# EAGLE board ArduinoInterface_v3.1 (EAGLE 9.2.1)
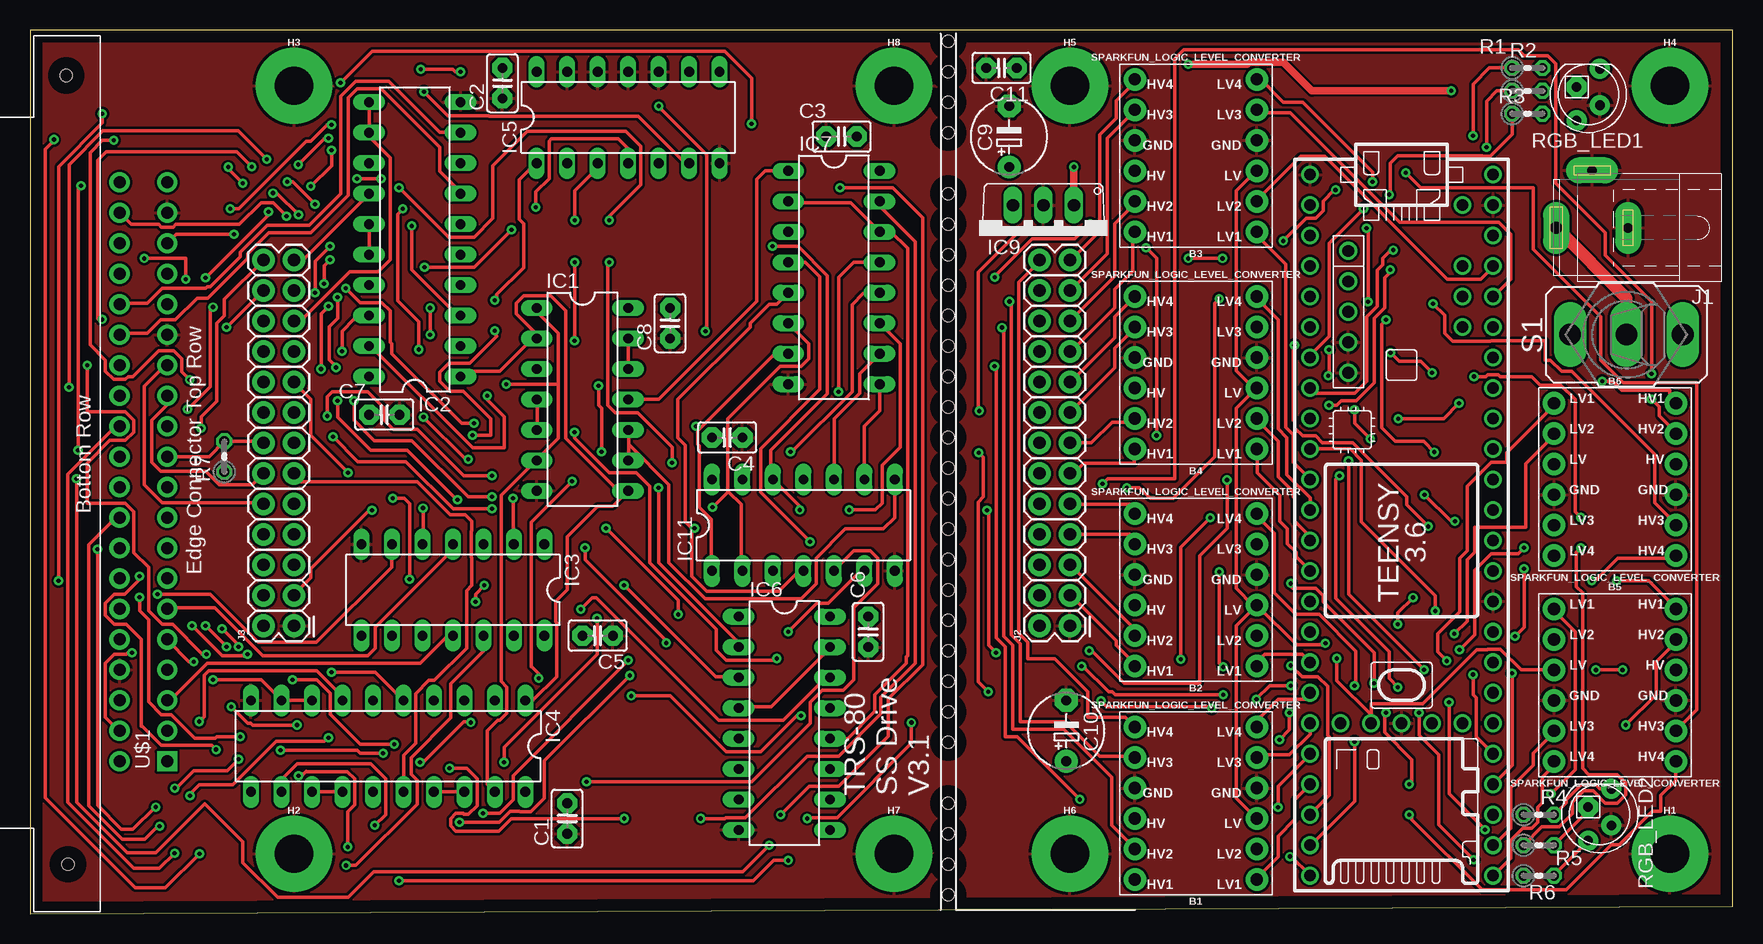
[diagram p1: board, top side]
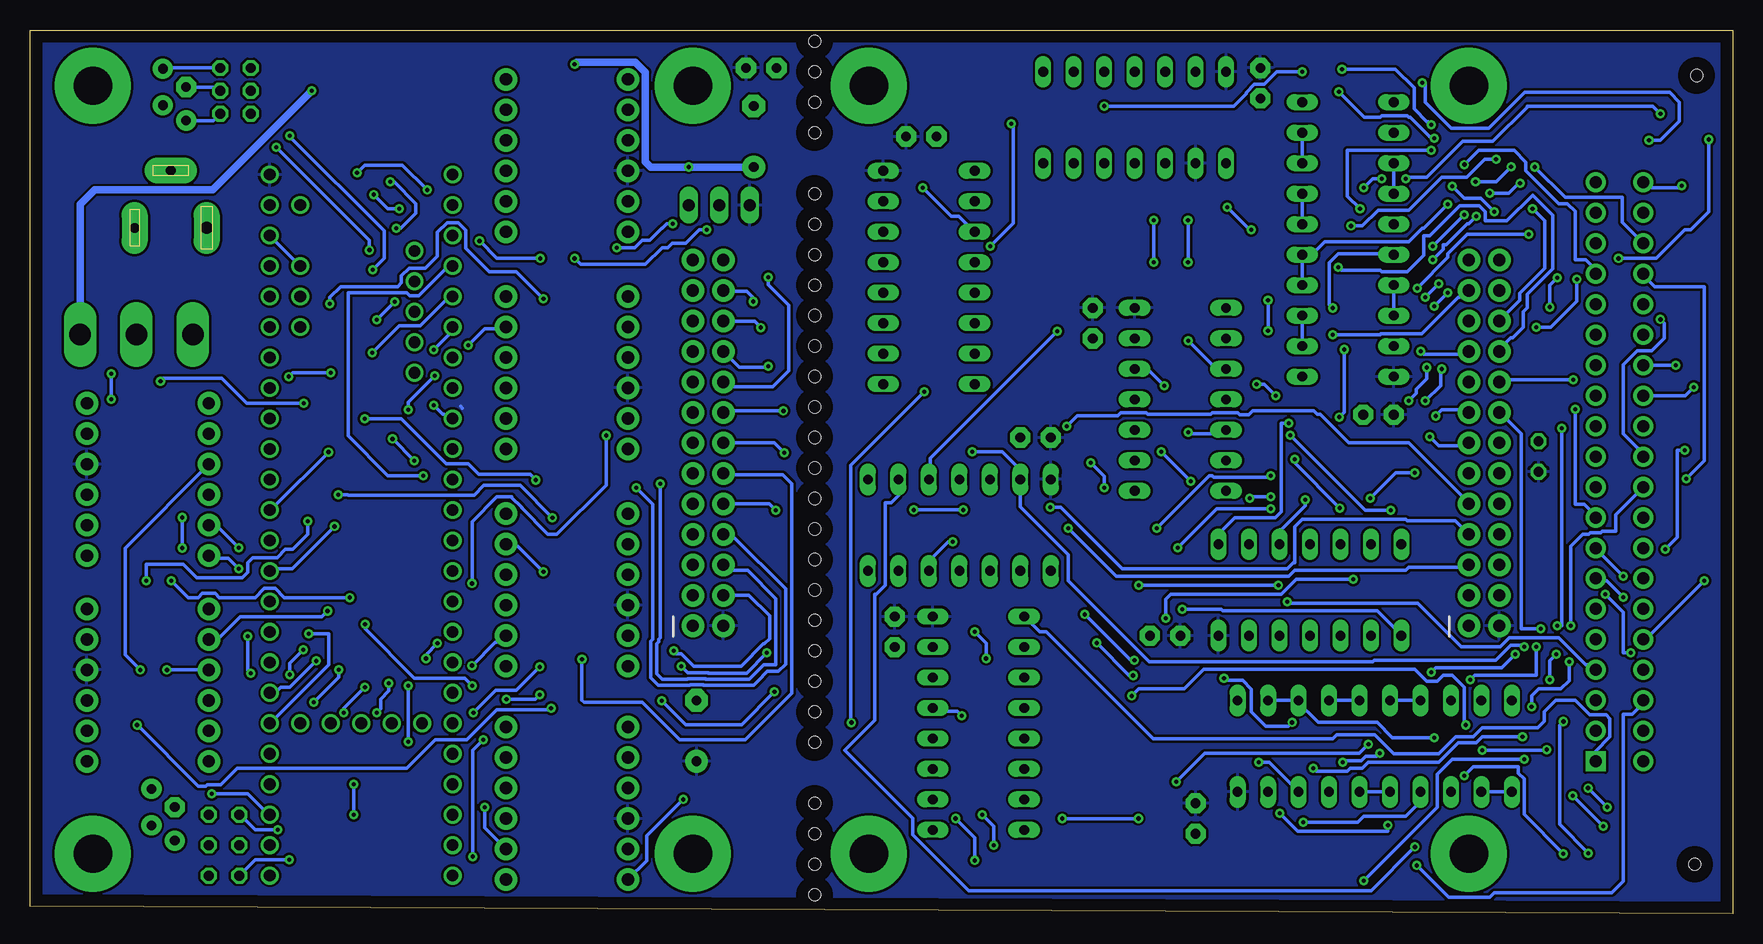
[diagram p2: board, bottom side, seen from below]

Size 141.9 x 73.65 mm. Coordinates in mm from the lower left corner, seen from the top.
Outline: 0,0 141.9,0.64 141.9,73.65 0,73.65 0,0
Copper layers (1*16): Top 0.035mm / dielectric 1.5mm / Bottom 0.035mm
Design rules "default": minimum track width 0.2mm, minimum drill 0.35mm, track to track 8mil, track to pad 8mil, pad to pad 8mil, via to via 8mil, smd to smd 8mil, copper to edge 40mil, drill to drill 6mil, minimum pad ring 10mil, minimum via ring 8mil, stop-mask expansion 4mil, vias tented up to drill 0mil, thermal gap 10mil
Net classes: 0 default: width 0.3 mm, clearance 0.05 mm
Holes 1 mm at 76.52,72.71 76.52,67.63 76.52,60.01 76.52,57.47 76.52,52.39 76.52,49.85 76.52,47.31 76.52,42.23 76.52,39.69 76.52,32.07 76.52,29.53 76.52,26.99 76.52,21.91 76.52,19.37 76.52,16.83 76.52,6.67 76.52,1.59 76.52,14.29 76.52,24.45 76.52,34.61 76.52,44.77 76.52,54.93 76.52,9.21 76.52,65.09 76.52,70.17 76.52,4.13 76.52,37.15

## Footprints (pad centres in the part's own frame; a part is rotated, then mirrored left to right if it is on the bottom)
SPARKFUN_LOGIC_LEVEL_CONVERTER = drill 1.016 pad 1.88: GND1 -5.08,-1.27; GND2 5.08,-1.27; HV 5.08,1.27; HV1 5.08,6.35; HV2 5.08,3.81; HV3 5.08,-3.81; HV4 5.08,-6.35; LV -5.08,1.27; LV1 -5.08,6.35; LV2 -5.08,3.81; LV3 -5.08,-3.81; LV4 -5.08,-6.35
C025-025X050 = drill 0.813 pad 1.676 octagon: 1 -1.27,0; 2 1.27,0
E5-6 = drill 0.813 pad 1.905: + -2.54,0 | drill 0.813 pad 1.905 octagon: - 2.54,0
STANDOFF-ELECTRICAL = drill 3.2 pad 6.35: P1 0,0
DIL14 = drill 0.813 long: 1 -7.62,-3.81; 2 -5.08,-3.81; 3 -2.54,-3.81; 4 0,-3.81; 5 2.54,-3.81; 6 5.08,-3.81; 7 7.62,-3.81; 8 7.62,3.81; 9 5.08,3.81; 10 2.54,3.81; 11 0,3.81; 12 -2.54,3.81; 13 -5.08,3.81; 14 -7.62,3.81
DIL20 = drill 0.813 long: 1 -11.43,-3.81; 2 -8.89,-3.81; 3 -6.35,-3.81; 4 -3.81,-3.81; 5 -1.27,-3.81; 6 1.27,-3.81; 7 3.81,-3.81; 8 6.35,-3.81; 9 8.89,-3.81; 10 11.43,-3.81; 11 11.43,3.81; 12 8.89,3.81; 13 6.35,3.81; 14 3.81,3.81; 15 1.27,3.81; 16 -1.27,3.81; 17 -3.81,3.81; 18 -6.35,3.81; 19 -8.89,3.81; 20 -11.43,3.81
DIL16 = drill 0.813 long: 1 -8.89,-3.81; 2 -6.35,-3.81; 3 -3.81,-3.81; 4 -1.27,-3.81; 5 1.27,-3.81; 6 3.81,-3.81; 7 6.35,-3.81; 8 8.89,-3.81; 9 8.89,3.81; 10 6.35,3.81; 11 3.81,3.81; 12 1.27,3.81; 13 -1.27,3.81; 14 -3.81,3.81; 15 -6.35,3.81; 16 -8.89,3.81
TO220V = drill 1.016 long: 1 -2.54,-2.54; 2 0,-2.54; 3 2.54,-2.54
SPC4077 = drill 0.8 pad 2.184 long: 1 -3,0; 2 0,-4.8 | drill 1 pad 2.184 long: 3 3,0
2X13 = drill 1.016 pad 1.88: 1 0,0; 2 0,2.54; 3 2.54,0; 4 2.54,2.54; 5 5.08,0; 6 5.08,2.54; 7 7.62,0; 8 7.62,2.54; 9 10.16,0; 10 10.16,2.54; 11 12.7,0; 12 12.7,2.54; 13 15.24,0; 14 15.24,2.54; 15 17.78,0; 16 17.78,2.54; 17 20.32,0; 18 20.32,2.54; 19 22.86,0; 20 22.86,2.54; 21 25.4,0; 22 25.4,2.54; 23 27.94,0; 24 27.94,2.54; 25 30.48,0; 26 30.48,2.54
0204V = drill 0.813 octagon: 1 -1.27,0; 2 1.27,0
LED5MMRGB = drill 0.8 pad 1.676: 1 -2.159,0.968; 3 0.889,0.968; 4 2.159,-0.968 | drill 0.8 pad 1.676 octagon: 2 -0.635,-0.968
M9040P = drill 1.803 long: 1 0,4.699; 2 0,0; 3 0,-4.699
EBC20DRAS = drill 1 pad 1.676 square: P$1 0,0 | drill 1 pad 1.676: P$2 0,3.969; P$3 2.54,0; P$4 2.54,3.969; P$5 5.08,0; P$6 5.08,3.969; P$7 7.62,0; P$8 7.62,3.969; P$9 10.16,0; P$10 10.16,3.969; P$11 12.7,0; P$12 12.7,3.969; P$13 15.24,0; P$14 15.24,3.969; P$15 17.78,0; P$16 17.78,3.969; P$17 20.32,0; P$18 20.32,3.969; P$19 22.86,0; P$20 22.86,3.969; P$21 25.4,0; P$22 25.4,3.969; P$23 27.94,0; P$24 27.94,3.969; P$25 30.48,0; P$26 30.48,3.969; P$27 33.02,0; P$28 33.02,3.969; P$29 35.56,0; P$30 35.56,3.969; P$31 38.1,0; P$32 38.1,3.969; P$33 40.64,0; P$34 40.64,3.969; P$35 43.18,0; P$36 43.18,3.969; P$37 45.72,0; P$38 45.72,3.969; P$39 48.26,0; P$40 48.26,3.969 | hole 1: -8.572,8.255; 57.15,8.414
TEENSY_3.5/3.6 = drill 0.965: 0/RX -25.4,-7.62; 1/TX -22.86,-7.62; 2 -20.32,-7.62; 3/CANTX -17.78,-7.62; 3V3 7.62,-7.62; 3V3_2 17.78,-2.54; 3V3_LO -22.86,7.62; 4/CANRX -15.24,-7.62; 5 -12.7,-7.62; 6 -10.16,-7.62; 7 -7.62,-7.62; 8 -5.08,-7.62; 9/CS -2.54,-7.62; 10/CS 0,-7.62; 11/MOSI 2.54,-7.62; 12/MISO 5.08,-7.62; 13/SCK 5.08,7.62; 14/A0 2.54,7.62; 15/A1 0,7.62; 16/A2 -2.54,7.62; 17/A3 -5.08,7.62; 18/A4/SDA -7.62,7.62; 19/A5/SCL -10.16,7.62; 20/A6 -12.7,7.62; 21/A7 -15.24,7.62; 21/DAC0 12.7,7.62; 22/A8 -17.78,7.62; 23/A9 -20.32,7.62; 24 10.16,-7.62; 25 12.7,-7.62; 26 15.24,-7.62; 27 17.78,-7.62; 28 20.32,-7.62; 29 22.86,-7.62; 30 25.4,-7.62; 31/A12 27.94,-7.62; 32/A13 30.48,-7.62; 33/A14 30.48,7.62; 34/A15 27.94,7.62; 35/A16 25.4,7.62; 36/A17 22.86,7.62; 37/A18 20.32,7.62; 38/A19 17.78,7.62; 39/A20 15.24,7.62; A10 -17.78,5.08; A11 -15.24,5.08; A22/DAC1 10.16,7.62; AGND -25.4,7.62; AREF -20.32,5.08; GND -27.94,-7.62; GND2 7.62,7.62; GND3 17.78,0; PROG 17.78,2.54; RESET 17.78,5.08; U5V -21.59,-4.445; UD+ -16.51,-4.445; UD- -19.05,-4.445; UGND1 -13.97,-4.445; UGND2 -11.43,-4.445; VBAT 17.78,-5.08; VIN -27.94,7.62; VUSB -25.4,5.08

## Placement (x,y rotation side)
B1  SPARKFUN_LOGIC_LEVEL_CONVERTER  [SPARKFUN_LOGIC_LEVEL_CONVERTER]  97.16,9.21 180 top
B2  SPARKFUN_LOGIC_LEVEL_CONVERTER  [SPARKFUN_LOGIC_LEVEL_CONVERTER]  97.16,26.99 180 top
B3  SPARKFUN_LOGIC_LEVEL_CONVERTER  [SPARKFUN_LOGIC_LEVEL_CONVERTER]  97.16,63.18 180 top
B4  SPARKFUN_LOGIC_LEVEL_CONVERTER  [SPARKFUN_LOGIC_LEVEL_CONVERTER]  97.16,45.09 180 top
B5  SPARKFUN_LOGIC_LEVEL_CONVERTER  [SPARKFUN_LOGIC_LEVEL_CONVERTER]  132.08,19.05 0 top
B6  SPARKFUN_LOGIC_LEVEL_CONVERTER  [SPARKFUN_LOGIC_LEVEL_CONVERTER]  132.08,36.2 0 top
C1  .1uf  [C025-025X050]  44.77,7.94 90 top
C2  .1uf  [C025-025X050]  39.37,69.22 90 top
C3  .1uf  [C025-025X050]  67.63,64.77 0 top
C4  .1uf  [C025-025X050]  58.1,39.69 180 top
C5  .1uf  [C025-025X050]  47.31,23.18 180 top
C6  .1uf  [C025-025X050]  69.85,23.5 90 top
C7  .1uf  [C025-025X050]  29.53,41.59 180 top
C8  .1uf  [C025-025X050]  53.34,49.21 90 top
C9  100uf  [E5-6]  81.6,64.77 90 top
C10  10uf  [E5-6]  86.36,15.24 90 top
C11  .1uf  [C025-025X050]  80.96,70.48 180 top
H1  STANDOFF_ELECTRICAL  [STANDOFF-ELECTRICAL]  136.66,5 0 top
H2  STANDOFF_ELECTRICAL  [STANDOFF-ELECTRICAL]  22,5 0 top
H3  STANDOFF_ELECTRICAL  [STANDOFF-ELECTRICAL]  22,69 0 top
H4  STANDOFF_ELECTRICAL  [STANDOFF-ELECTRICAL]  136.66,69 0 top
H5  STANDOFF_ELECTRICAL  [STANDOFF-ELECTRICAL]  86.67,69 0 top
H6  STANDOFF_ELECTRICAL  [STANDOFF-ELECTRICAL]  86.67,5 0 top
H7  STANDOFF_ELECTRICAL  [STANDOFF-ELECTRICAL]  72,5 0 top
H8  STANDOFF_ELECTRICAL  [STANDOFF-ELECTRICAL]  72,69 0 top
IC1  74LS00N  [DIL14]  46.04,42.86 270 top
IC2  74LS244N  [DIL20]  32.07,56.2 90 top
IC3  74LS30N  [DIL14]  35.24,26.99 180 top
IC4  74LS244N  [DIL20]  29.84,13.97 180 top
IC5  74S74N  [DIL14]  49.85,66.36 0 top
IC6  74LS139N  [DIL16]  62.87,15.88 270 top
IC7  74LS155N  [DIL16]  66.99,53.02 270 top
IC9  7805TV  [TO220V]  84.45,56.52 180 top
IC11  74LS20N  [DIL14]  64.45,32.38 0 top
J1  Connector  [SPC4077]  130.18,57.15 180 top
J2  TEENSY_CONN  [2X13]  86.67,24 90 top
J3  GLUE_CONN  [2X13]  22,24 90 top
R1  330  [0204V]  124.78,70.48 0 top
R2  330  [0204V]  124.78,68.58 0 top
R3  330  [0204V]  124.78,66.67 0 top
R4  330  [0204V]  125.73,8.26 0 top
R5  330  [0204V]  125.73,5.71 0 top
R6  330  [0204V]  125.73,3.17 0 top
R7  4.7k  [0204V]  16.19,38.1 90 top
RGB_LED1  5MMRGBLED  [LED5MMRGB]  129.86,68.26 270 top
RGB_LED2  5MMRGBLED  [LED5MMRGB]  130.81,8.26 270 top
S1  SW-ON-OFF  [M9040P]  133.03,48.26 90 top
U$1  EBC20DRAS  [EBC20DRAS]  11.43,12.7 90 top
U$2  TEENSY_3.5/3.6  [TEENSY_3.5/3.6]  114.3,33.66 270 top

## Tracks (layer width: path | path; a pad name or v marks a point on that pad's centre or on a via)
3XXX_
  Top 0.3: IC6.4 59.12,17.25 61.75,17.25 66.62,22.12 IC6.15
9V  (via drill 0.35)
  Top 0.61: v118.43,68.58 106.82,68.58 104.42,70.98 101.64,70.98 101.46,70.8 v96.52,70.8 | IC9.1 v87,62.23
  Bottom 0.61: S1.3 137.73,59.12 136.53,60.33 126.68,60.33 v118.43,68.58 | v96.52,70.8 96.34,70.98 91.47,70.98 90.63,70.13 90.63,62.69 90.17,62.23 v87,62.23 C9.+
9V_TO_SW
  Top 1.016: J1.3 133.03,51.29 S1.2
37E0RD_  (via drill 0.35)
  Top 0.3: 55.75,40.38 62,46.62 63.12,46.62 IC7.7 | 55.75,40.38 55.62,40.25 55.62,39.12 55.75,39 55.75,33.88 56.75,32.88 56.75,28.62 IC11.1 | 55.75,40.38 v55.5,40.62
  Bottom 0.3: v55.5,40.62 54.62,41.5 51.25,41.5 51,41.75 48.88,41.75 48.75,41.62 43.5,41.62 43.38,41.75 41.25,41.75 41.09,41.59 40.32,41.59 40.01,41.91 34.92,41.91 34.64,41.62 34.4,41.62 32.03,39.25 27,39.25 22,34.25 J3.9
37E0RD_HV_SLLC_
  Top 0.3: J2.9 86.75,34.12 92,34.12 92,33.38 B2.HV4
37E0RD_LV_  (via drill 0.35)
  Top 0.3: v110.38,14.32 110.38,9.38 106.75,5.75 U$2.31/A12 | B2.LV4 102.25,33.25 102.25,33.12 103.68,31.69 103.68,26.73 105.47,24.95 107.44,24.95 110.49,21.89 110.49,19.11 v110.38,19
  Bottom 0.3: v110.38,19 v110.38,14.32
37E0WR_  (via drill 0.35)
  Top 0.3: IC7.9 70.8,41.91 69.53,40.64 IC11.9 | v16.38,48.88 19.38,51.88 J3.24 | v12.99,52.88 12.99,54.62 9.54,54.62 v9.53,54.61 | v2,64.52 2,64.46 1.25,63.71 1.25,9.68 8.78,2.15 11.27,2.15 v14.12,5.01 | v22.38,11.5 22.62,11.5 23,11.88 23.04,11.83 26.45,11.83 27.05,11.24 27.05,9.08 26.49,8.52 v26.49,5.57
  Bottom 0.3: v16.38,48.88 15.17,48.88 12.99,51.06 v12.99,52.88 | v2,64.52 2,58.5 3.5,57 4,57 6.39,54.61 v9.53,54.61 | v22.38,11.5 21.62,12.25 17.88,12.25 17.88,11.71 17.4,11.24 17.4,8.28 v14.12,5.01 | IC11.9 69.5,36.12 69.5,34.88 70.12,34.25 70.62,34.25 70.62,27.38 71.38,26.62 71.5,26.62 71.5,16.12 74,13.62 68.35,7.97 68.35,6.57 63.69,1.91 30.15,1.91 v26.49,5.57
37E0WR_LV_
  Top 0.3: U$2.27 106.68,14.98 104.95,13.25 102.25,13.25 102.25,13.12 B1.LV3
37E0WR_LV_SLLC_  (via drill 0.35)
  Top 0.3: v81.62,51.02 81.75,51.02 81.75,23.25 82.5,22.5 82.5,16 86.25,16 89.12,13.12 92,13.12 B1.HV3
  Bottom 0.3: v81.62,51.02 81.62,51.34 82.16,51.88 84.12,51.88 J2.24
37E4RD_  (via drill 0.35)
  Top 0.3: 58.19,35.19 58.12,35.25 58.12,41.25 62.5,45.62 64.25,45.62 64.88,46.25 64.88,47.5 63.25,49.12 IC7.6 | 58.19,35.19 59.25,34.12 59.25,28.62 IC11.2 | 58.19,35.19 v56.88,33.88
  Bottom 0.3: v56.88,33.88 56,33.88 50.88,28.75 37.12,28.75 36.62,29.25 36.5,29.25 36.5,32.25 35.88,32.88 27.25,32.88 27.12,32.75 23.12,32.75 J3.7
37E4RD_HV_SLLC_
  Top 0.3: J2.7 86.75,31.62 91.62,31.62 92,31.25 92,30.88 B2.HV3
37E4RD_LV_  (via drill 0.35)
  Top 0.3: v105,4.77 105.11,4.77 106.62,3.25 U$2.32/A13 | v104.95,16.75 104.95,15.33 v104.12,14.5 | v99.11,28.49 99.11,20.89 v99.43,20.57
  Bottom 0.3: v104.95,16.75 103.08,18.62 101.38,18.62 v99.43,20.57 | v99.11,28.49 101.25,30.62 102,30.62 102.12,30.75 B2.LV3 | v104.12,14.5 105,13.62 v105,4.77
37E4WR_  (via drill 0.35)
  Top 0.3: IC11.10 67,36.25 67,41.25 69.12,43.38 69.12,45 70.75,46.62 IC7.10 | v16.69,58.76 17.39,58.76 23,64.38 23.38,64.38 24.75,65.75 v25.12,65.75 | v32.57,70.38 35.24,70.38 35.45,70.17 v35.88,70.17 | v56.29,48.54 56.38,48.63 56.38,63.25 52.39,67.24 v52.39,67.31
  Bottom 0.3: v25.12,65.75 25.38,66 25.5,66 26.57,67.07 26.57,68.82 28.12,70.38 v32.57,70.38 | v56.29,48.54 66.88,37.95 66.88,36.25 IC11.10 | J3.22 19.38,49.5 17.75,51.12 17.75,51.71 15.68,53.78 15.68,57.75 v16.69,58.76 | v35.88,70.17 38,70.17 39.03,69.14 39.86,69.14 40.56,68.44 40.56,68.34 41.59,67.31 v52.39,67.31
37E4WR_HV_SLLC_  (via drill 0.35)
  Top 0.3: v81,48.85 81.12,48.97 81.12,23.12 81.88,22.38 81.88,15.38 86.12,15.38 90.12,11.38 90.12,7.38 92,5.5 B1.HV2
  Bottom 0.3: v81,48.85 81.53,49.38 84.12,49.38 J2.22
37E4WR_LV_  (via drill 0.35)
  Top 0.3: v104,8.88 104,10.62 106.62,13.25 U$2.28
  Bottom 0.3: B1.LV2 104,7.16 v104,8.88
37E8RD_  (via drill 0.35)
  Top 0.3: 55.12,32.12 55.12,32.14 54.61,32.66 54.61,39.05 53.98,39.69 53.98,42.86 60.01,48.9 60.01,49.21 61.59,50.8 62.23,50.8 IC7.5 63.12,51.75 | 55.12,32.12 55.12,28.12 56.38,26.88 62.38,26.88 64,28.5 64.38,28.5 IC11.4 | v55.38,32.12 55.12,32.12
  Bottom 0.3: v55.38,32.12 51.38,28.12 37,28.12 36.5,28.62 27.25,28.62 27,28.88 22.12,28.88 22,29 J3.5
37E8RD_HV_SLLC_
  Top 0.3: J2.5 86.75,29 92,23.75 92,23.25 B2.HV2
37E8RD_LV_  (via drill 0.35)
  Top 0.3: U$2.30 106.75,8.38 108.25,9.88 108.25,14.75 108.12,14.88 108.12,18.94 107.32,19.75 106,19.75 v105.07,20.68
  Bottom 0.3: v105.07,20.68 103.12,22.62 103,22.62 102.5,23.12 102.25,23.12 B2.LV2
37E8WR_  (via drill 0.35)
  Top 0.3: IC7.11 70.88,49.12 72.5,47.5 72.5,38.86 71,37.36 71,34.23 70.42,33.66 v68.26,33.66 | v13.3,44.5 12.62,45.17 12.62,46.25 11.97,46.9 11.94,46.9 11.92,46.91 10.72,46.91 8.57,44.77 8.19,44.77 7.96,44.53 6.97,44.53 6.27,45.23 6.27,46.14 5,47.41 5,63.42 6.03,64.45 v6.99,64.45 | v25.88,69.25 28.5,71.88 57.88,71.88 60.12,69.62 v60.12,65.82 | v61.88,55.62 64,55.62 66.44,53.18 66.44,43.32 61.74,38.62 61.74,36.37 IC11.12 64.14,33.97 v64.14,33.66
  Bottom 0.3: v13.3,44.5 19.25,44.5 19.38,44.38 J3.18 | v25.88,69.25 25.62,69.25 25.62,67.64 23.46,65.47 20.33,65.47 17.35,68.45 5.27,68.45 4.45,67.63 4.45,66.04 6.03,64.45 v6.99,64.45 | v61.88,55.62 59.97,57.53 59.97,65.66 v60.12,65.81 v60.12,65.82 | v68.26,33.66 v64.14,33.66
37E8WR_HV_SLLC_  (via drill 0.35)
  Top 0.3: B5.HV4 137.12,12.62 137.12,11.11 135.89,9.87 135.89,8.53 135.2,8.53 132.43,5.75 131.75,5.75 128,2 121,2 115.16,7.84 115.16,8.03 v114.94,8.26 | v80.39,53.04 80.34,53.09 83.5,56.25 87.06,56.25 87.68,56.88 87.7,56.88 v88.34,57.51 | v93,55.5 93.88,54.62 v93.88,39.86 | v112,19.2 112,21.77 107.77,26 107.77,26.49 107.13,27.12 105.23,27.12 105.07,27.29 v105.07,27.53 | v113,16.75 112.88,16.62 112.88,15.12 115.16,12.84 115.16,11.02 v114.94,10.79
  Bottom 0.3: J2.18 83.73,43.92 80,43.92 78.67,45.25 78.67,50.7 80.39,52.41 v80.39,53.04 | v93,55.5 91.5,55.5 90.88,56.12 90.25,56.12 89.24,57.13 89.23,57.13 88.86,57.51 v88.34,57.51 | v93.88,39.86 93.88,35.73 97.99,31.61 98.74,31.61 100.94,33.82 100.94,33.87 101.75,34.68 101.75,34.75 103,34.75 105.07,32.68 v105.07,27.53 | v112,19.2 112,18.57 112.68,17.89 112.68,17.07 v113,16.75 | v114.94,10.79 v114.94,8.26
37E8WR_LV_
  Top 0.3: B5.LV4 127,12.38 126,11.38 126,9.25 125.62,8.88 125.62,7.62 125.12,7.12 124.38,7.12 123.38,6.12 123.38,4.62 122,3.25 U$2.33/A14
37ECRD_  (via drill 0.35)
  Top 0.3: v65,31 60.88,35.12 60.88,38.75 65.82,43.69 65.82,53.1 64.62,54.29 IC7.4 | v14.25,40.46 14.25,41.41 15.56,42.72 15.56,49.21 16.19,49.85 16.19,51.21 J3.26 | v16.38,22.25 v14.62,24 | v21.88,19.5 23.88,19.5 25,18.38 25,16.62 27.5,14.12 v30.36,14.12 | v46.38,11 60.12,11 65,15.88 65,17.62 66,18.62 67.75,18.62 68.62,19.5 68.62,25.5 70.62,27.5 70.62,29.62 70,30.25 68.62,30.25 67,28.62 IC11.5
  Bottom 0.3: v65,31 65.38,31 66.75,29.62 66.88,29.62 66.88,28.62 IC11.5 | v14.25,40.46 14.25,24 v14.62,24 | v16.38,22.25 16.38,19.88 21.5,19.88 v21.88,19.5 | v46.38,11 44,13.38 31.11,13.38 v30.36,14.12
37ECRD_HV_SLLC_
  Top 0.3: B1.HV4 92,15.62 91.26,16.36 88.12,16.36 88.12,18.5 85.38,21.25 83.12,21.25 83.12,22.62 82.38,23.38 82.38,52.62 84.12,54.38 J2.26
37ECRD_LV_
  Top 0.3: U$2.26 106.68,18.23 106.33,17.88 104,17.88 102.25,16.12 102.25,15.62 B1.LV4
37ECWR_  (via drill 0.35)
  Top 0.3: v63.38,38.49 63.49,38.49 68.5,43.5 68.5,50.77 69.42,51.69 IC7.12 | v16,23.75 17.38,22.38 v17.38,22.25
  Bottom 0.3: v63.38,38.49 60.87,38.49 59.62,37.25 59.38,37.25 59.38,36.25 IC11.13 59.38,36.12 59.38,33.92 55.38,29.92 55.38,27.75 48.62,21 30,21 29.88,21.12 19.75,21.12 18.5,22.38 17.5,22.38 v17.38,22.25 | v16,23.75 17.62,23.75 17.62,40 19.38,41.75 J3.16
37ECWR_HV_SLLC_  (via drill 0.35)
  Top 0.3: v79.11,41.9 79,42.02 79,53.45 82.55,57 v85.5,57 | v114.64,61.75 115.89,60.5 125.25,60.5 125.25,55.38 130.88,49.75 130.88,46.12 132.75,44.25 138.88,44.25 138.88,17 137.25,15.38 137.25,15.25 B5.HV3 | v96.52,54.61 v99.38,54.61 | v108.8,60.32 108.69,60.32 107.77,59.4 107.77,58.6 107.13,57.97 106.34,57.97 v104.44,56.07
  Bottom 0.3: v79.11,41.9 79.14,41.93 84.07,41.93 84.12,41.88 J2.16 | v85.5,57 86.14,57 87.26,55.88 88.39,55.88 88.77,55.5 89.23,55.5 90.61,54.12 96.03,54.12 v96.52,54.61 | v108.8,60.32 110.86,62.38 114.01,62.38 v114.64,61.75 | v99.38,54.61 101.77,54.61 101.79,54.63 103,54.63 v104.44,56.07
37ECWR_LV_
  Top 0.3: U$2.34/A15 122,5.75 123.38,7.12 123.38,10.5 125.25,12.38 125.25,13.38 127,15.12 B5.LV3
37EX_
  Top 0.3: IC7.2 63.25,59.25 68.38,59.25 70.75,56.88 IC7.14 71.75,56.83 73.12,55.45 73.12,21.5 73.03,21.4 73.03,20.86 70.41,18.25 70.41,16.87 68.14,14.61 IC6.12
37EX_WR_RD  (via drill 0.35)
  Top 0.3: IC5.3 47.25,62.5 47.25,62.12 45.38,60.25 45.38,57.81 v45.4,57.78 | v45.38,47.75 45.4,47.78 v45.4,54.29
  Bottom 0.3: v45.38,47.75 43.38,45.75 42.5,45.75 42.25,45.5 IC1.3 | v45.4,57.78 v45.4,54.29
37EXRD  (via drill 0.35)
  Top 0.3: IC1.5 42.25,40.38 42.25,42.75 IC1.4 | v45.38,40.12 45.38,39.62 48.25,36.75 50.5,36.75 51.62,35.62 51.62,29.25 57.17,23.7 57.17,21.95 58,21.12 61.91,21.12 62,21.21 62.17,21.21 v62.23,21.27 | IC11.6 69.5,28.5 69.12,28.5 66.5,25.88 65.56,25.88 v63.18,23.5
  Bottom 0.3: v45.38,40.12 45.25,40 42.5,40 42.25,40.25 IC1.5 | v63.18,23.5 62.23,22.54 v62.23,21.27
37EXRD_  (via drill 0.35)
  Top 0.3: 44,44.13 44,39.62 42.25,37.88 IC1.6 42.12,37.75 39.25,34.88 39.25,19.36 39.75,18.86 39.75,16.7 39.16,16.11 38.97,16.11 38.1,15.24 38.1,10.8 IC4.19 | 44,44.13 44,48.38 42.25,50.12 42.25,50.38 IC1.1 | IC2.19 28.41,47.31 36.89,38.83 39.52,38.83 39.52,41.43 38.1,42.85 v38.1,43.18 | v39.69,44.13 44,44.13
  Bottom 0.3: v39.69,44.13 39.05,44.13 v38.1,43.18
37EXWR
  Top 0.3: 49.88,39 49.88,40.25 IC1.10 | 49.88,39 49.88,37.88 IC1.9 | 49.88,39 50,39 53.23,35.77 53.23,29.27 56.25,26.25 64.25,26.25 65.5,27.5 65.5,29.62 67.94,32.07 71.12,32.07 72.07,33.02 IC11.8
37EXWR_
  Top 0.3: IC2.1 36.36,45.19 39.12,45.19 41.85,47.92 41.89,47.94 IC1.2 42.12,48 42.12,48.38 40.5,50 40.5,50.88 41.12,51.5 43.38,51.5 44.62,50.25 44.62,39.62 49.38,34.88 IC1.8 48.58,33.97 47.31,33.97 44.77,31.43 44.77,26.99 43.81,26.04 43.81,24.32 43.88,24.26 43.88,19.75 41.91,17.78 IC4.1
A0
  Top 0.3: U$1.P$25 11.38,43.12 11.38,42.38 10.12,41.12 10.12,37.62 10.88,36.88 14.62,36.88 15.75,35.75 18.5,35.75 19.38,36.62 J3.12
A0_HV_SLLC  (via drill 0.35)
  Top 0.3: v132.21,27.75 134.88,27.75 137.12,25.5 B5.HV1 | v116.2,34.92 118.43,32.7 v118.75,32.7 | v98.36,33 95.91,30.54 v95.91,21.21
  Bottom 0.3: v132.21,27.75 132.21,29.14 129.13,29.14 128.02,28.02 124.2,28.02 123.77,28.45 123.77,29.27 123.35,29.68 121.32,29.68 120.62,30.38 120.02,30.38 118.75,31.64 v118.75,32.7 | J2.12 84.12,36.62 83.38,36.62 83.33,36.58 79.16,36.58 78.44,35.85 78.44,18.36 82.31,14.49 87.75,14.49 90.89,17.62 95.73,17.62 95.91,17.8 v95.91,21.21 | v116.2,34.92 115.42,34.92 115.38,34.88 104.89,34.88 104.08,35.69 101.06,35.69 v98.36,33
A0_LV  (via drill 0.35)
  Top 0.3: v126.75,10 128.75,12 128.75,23.5 127,25.25 B5.LV1
  Bottom 0.3: v126.75,10 123.75,10 122.38,8.62 122.25,8.62 122,8.38 U$2.35/A16
A1
  Top 0.3: U$1.P$27 11.27,45.72 9.5,43.95 9.5,35.75 11,34.25 19.38,34.25 J3.10
A1_HV_SLLC  (via drill 0.35)
  Top 0.3: v79.75,33.62 79.88,33.49 79.88,22.38 v80.5,21.75 | v99.43,18.25 90.42,18.25 90.17,18.5 89.89,18.5 87.75,20.64 v87.63,20.64 | v102.2,17.88 102.2,17.91 103.3,19 v105.06,19 | v130.13,27.75 130.45,27.75 132.33,29.62 137.12,29.62 137.12,29.75 B6.HV4 | v115.25,26.35 113.98,25.08 v113.98,24.13
  Bottom 0.3: J2.10 80.29,34.16 v79.75,33.62 | v99.43,18.25 99.81,17.88 v102.2,17.88 | v105.06,19 105.68,19.62 109.88,19.62 113.98,23.73 v113.98,24.13 | v130.13,27.75 130.12,27.75 128.72,26.35 127.88,26.35 127.54,26.69 126.46,26.69 126.12,26.35 123.14,26.35 122.37,27.12 121.47,27.12 120.7,26.35 v115.25,26.35 | v80.5,21.75 80.5,21.73 82.18,20.06 85.37,20.06 85.4,20.09 87.08,20.09 v87.63,20.64
A1_LV  (via drill 0.35)
  Top 0.3: U$2.36/A17 123.5,12.38 v123.5,20.04 | v123.75,23.12 124.5,23.88 v124.5,28.75
  Bottom 0.3: v123.5,20.04 123.75,20.29 v123.75,23.12 | v124.5,28.75 125.38,29.62 126.88,29.62 127,29.75 B6.LV4
A2  (via drill 0.35)
  Top 0.3: IC7.13 68.63,54.29 67.38,53.04 v67.38,43.5 | v73.45,15.93 73.45,14.2 67.25,8 64.83,8 v64.77,7.94 | v30.75,2.75 60.29,2.75 61.98,4.45 v63.18,4.45 | v17.38,12.88 16.42,11.92 13.65,11.92 12.21,10.48 v12.06,10.48 | v4,38.62 4,60.41 v4.25,60.66 | v5.62,30.38 5.62,9.03 7.62,7.04 8.57,7.04 10.42,8.89 v10.48,8.89
  Bottom 0.3: v67.38,43.5 73.5,37.38 73.5,15.93 v73.45,15.93 | v30.75,2.75 24.62,8.88 24.62,11.62 23.38,12.88 v17.38,12.88 | v5.62,30.38 4.62,31.38 4.62,38.62 v4,38.62 | v4.25,60.66 4.42,60.5 6.75,60.5 7.12,60.88 7.38,60.88 U$1.P$40 | v63.18,4.45 63.18,6.35 v64.77,7.94 | v12.06,10.48 v10.48,8.89
A3  (via drill 0.35)
  Top 0.3: v67.5,60.5 71.88,60.5 74.38,58 74.38,20.75 71.54,17.91 71.54,14.79 67.38,10.62 64.92,10.62 v62.55,8.26 | v3.88,36.25 3.88,9.3 8.1,5.08 10.48,5.08 14.57,9.18 17.73,6.02 17.73,4.27 20.62,1.38 26.52,1.38 28.64,3.5 59.38,3.5 v61.59,5.71
  Bottom 0.3: v67.5,60.5 65.12,58.12 64.5,58.12 63.25,56.88 IC7.3 | v3.88,36.25 2.38,37.75 2.38,52.25 6.5,52.25 7.5,53.25 U$1.P$34 | v61.59,5.71 61.59,7.3 v62.55,8.26
A5  (via drill 0.35)
  Top 0.3: v26.31,52.13 27.51,50.93 29.32,50.93 30,50.25 30,47.65 30.16,47.48 30.16,46.67 35.96,40.88 v37,40.88 | v17,56.62 12.18,56.62 U$1.P$35
  Bottom 0.3: v37,40.88 37.62,40.88 37.62,33.5 38.12,33 41.5,33 42.62,31.88 42.75,31.88 42.75,30.88 IC3.1 | v26.31,52.13 23.75,54.69 23.75,55 22.12,56.62 v17,56.62
A6  (via drill 0.35)
  Top 0.3: v40.25,34.62 40.25,30.88 IC3.2 | v38.5,34.75 36.5,34.75 31.82,39.43 28.69,39.43 27,41.12 v27,42.75 | v25.5,45.52 25.5,45.6 24.93,46.17 24.93,48.92 25.62,49.62 v25.62,51.38 | v24.5,52.5 24.5,54 v25,54.5 | v21.38,58.12 20.25,59.25 19.26,59.25 17.45,57.44 12.14,57.44 11.92,57.23 10.94,57.23 10.72,57.44 8.43,57.44 7.5,58.38 U$1.P$38
  Bottom 0.3: v40.25,34.62 40.12,34.75 v38.5,34.75 | v27,42.75 26.36,43.38 26.36,43.7 25.5,44.57 v25.5,45.52 | v25.62,51.38 v24.5,52.5 | v25,54.5 24.12,55.38 24.12,55.75 23.88,55.75 22.12,57.5 22,57.5 v21.38,58.12
A7  (via drill 0.35)
  Top 0.3: v35.62,34.5 35.57,34.5 31.44,38.62 28.38,38.62 25.62,41.38 v25.62,42.75 | v24.25,45.4 24.25,50 v24.88,50.62 | v23.75,51.75 23.75,54.38 v25,55.62 | v22.38,58.25 20.57,60.06 v20.25,60.06 | v17.73,60.87 16.51,62.09 v16.51,62.23
  Bottom 0.3: v35.62,34.5 35.62,34 37.62,32 37.75,32 37.75,30.88 IC3.3 | v25.62,42.75 24.36,44.02 24.36,45.29 v24.25,45.4 | v23.75,51.75 v24.88,50.62 | v22.38,58.25 v25,55.62 | v17.73,60.87 17.86,60.87 18.66,60.06 v20.25,60.06 | v16.51,62.23 13.97,59.69 9.21,59.69 9.21,57.63 U$1.P$36
A8
  Top 0.3: IC3.4 35.12,30.75 35.12,30.25 28.75,23.88 28.75,22.12 28.12,21.5 19.38,21.5 15.38,25.5 11.5,25.5 U$1.P$11
A9  (via drill 0.35)
  Top 0.3: v32.75,33.81 32.75,30.88 IC3.5 | v36.51,37.88 36.3,37.88 v32.79,41.39 | v32.38,47.02 32.38,49.31 30.62,51.08 30.62,58.3 v31.07,58.74 | v25.12,63.62 25.12,62.35 v23.39,60.62 | v19.88,58.5 19.88,58.25 v14.62,53 | v15.25,50.56 15,50.31 15,43.92 v13.12,42.05
  Bottom 0.3: v36.51,37.88 36.51,37.57 v32.75,33.81 | v32.38,47.02 32.38,41.8 v32.79,41.39 | v31.07,58.74 32.13,59.81 32.13,63.62 v25.12,63.62 | v23.39,60.62 22.39,59.62 21,59.62 v19.88,58.5 | v14.62,53 15.25,52.38 v15.25,50.56 | v13.12,42.05 13.12,34.12 12.38,34.12 11.38,33.12 U$1.P$17
A10  (via drill 0.35)
  Top 0.3: v10.62,26.62 15,26.62 19,22.62 23.86,22.62 30.12,28.89 30.12,30.75 IC3.6 | v8.5,21.75 8.12,21.75 8,21.62 7,21.62 6.25,20.88 6.25,16.38 7.38,15.25 U$1.P$4
  Bottom 0.3: v10.62,26.62 9.12,25.12 9.12,21.75 v8.5,21.75
A11  (via drill 0.35)
  Top 0.3: v64.25,16.5 63.88,16.5 60.88,13.5 58,13.5 53.35,18.15 v50.09,18.15 | v13.63,21.01 13.24,21.01 11.5,22.75 U$1.P$9 | v16.77,17.24 18.14,15.88 18.41,15.88 18.56,15.73 v22.25,15.73
  Bottom 0.3: v64.25,16.5 64.62,16.88 66.38,16.88 66.62,17.12 IC6.13 | v22.25,15.73 22.38,15.73 22.38,18.88 23.38,19.88 24.12,19.88 24.62,19.38 25.5,19.38 26.5,20.38 44.08,20.38 45.72,18.73 49.52,18.73 v50.09,18.15 | v13.63,21.01 13.63,19.42 14.32,18.73 16.19,18.73 16.77,18.16 v16.77,17.24
A12
  Top 0.3: IC3.11 35.12,23.12 34.75,23.12 32.5,20.88 14.75,20.88 11.75,17.88 11.5,17.88 U$1.P$5
A13  (via drill 0.35)
  Top 0.3: v26.34,4.03 27.16,4.03 32.25,9.12 32.25,11.12 31.75,11.62 31.75,13 35.07,16.32 35.07,19.15 37.83,21.92 37.83,23.13 IC3.12
  Bottom 0.3: v26.34,4.03 23.68,1.38 20.25,1.38 19.88,1.75 10.1,1.75 9.12,2.73 9.12,16.62 8.38,16.62 7.5,17.5 7.5,17.75 U$1.P$6
A14  (via drill 0.35)
  Top 0.3: v52.38,35.5 52.38,29.25 59,22.62 59,22.25 IC6.2 | v53.5,37.58 53.5,38.88 50.62,41.75 48.75,41.75 48.12,42.38 48.12,54.16 v48.26,54.29 | v30.75,60.5 34.88,56.38 37,56.38 38.58,57.95 38.58,62.35 41.42,65.19 49.62,65.19 50.88,63.94 50.88,60.74 48.26,58.12 v48.26,57.78 | v27.25,61.25 v29.25,61.25 | v2.38,27.75 2.38,62.27 6.03,65.93 v6.03,66.67
  Bottom 0.3: v53.5,37.58 52.38,36.45 v52.38,35.5 | v30.75,60.5 30,61.25 v29.25,61.25 | v27.25,61.25 27.12,61.38 25.5,61.38 22.51,64.36 19.99,64.36 17.14,67.21 17.14,67.31 6.67,67.31 v6.03,66.67 | v2.38,27.75 7.25,22.88 7.38,22.88 U$1.P$10 | v48.26,57.78 v48.26,54.29
A15  (via drill 0.35)
  Top 0.3: v49.5,27.38 57.12,19.75 59,19.75 IC6.3 | v37.87,27.38 37.12,26.64 v37.12,26
  Bottom 0.3: v37.87,27.38 v49.5,27.38 | v37.12,26 37,25.88 26.25,25.88 22.62,22.25 19.38,22.25 18.62,23 14.5,23 12.25,20.75 12.12,20.75 11.75,20.38 11.5,20.38 U$1.P$7
D0
  Top 0.3: U$1.P$30 7.5,48.38 9.75,48.38 10.88,49.5 12.12,49.5 13.92,51.31 14.81,51.31 18.12,54.62 18.12,55 19.88,56.75 23.38,56.75 26.5,59.88 26.5,68 27.25,68.75 29.25,68.75 34.12,63.88 34.12,61.88 35.88,60.12 IC2.7
  Bottom 0.3: IC2.7 IC2.6
D0_HV
  Top 0.3: IC2.14 22.73,54.48 J3.25
  Bottom 0.3: IC2.13 IC2.14
D0_HV_SLLC
  Top 0.3: J2.25 86.75,54.5 89.12,56.88 89.12,64.92 90.5,66.3 90.5,67.75 92,69.25 92,69.5 B3.HV4
D0_LV  (via drill 0.35)
  Top 0.3: v113,49.5 112.62,49.12 112.62,40.5 113.75,39.37 116.13,39.37 v117.03,38.47 | v111.38,57.12 111.5,56.99 v111.5,51 | B3.LV4 102.55,69.53 104.46,67.63 106.05,67.63 111.88,61.8 v111.88,61
  Bottom 0.3: v117.03,38.47 121.5,34 121.62,34 121.88,33.75 U$2.15/A1 | v111.5,51 v113,49.5 | v111.38,57.12 111,57.12 109.74,58.38 109.74,59.18 111.56,61 v111.88,61
D1  (via drill 0.35)
  Top 0.3: v18.48,62.25 17.21,63.52 6.37,63.52 5.62,62.78 5.62,49.6 5.96,49.6 v6.03,49.53 | v21.44,61 21.88,61 v23.75,59.12
  Bottom 0.3: IC2.4 IC2.5 35.75,55 35,55 34,56 27,56 25.88,57.12 25.75,57.12 v23.75,59.12 | v18.48,62.25 19.73,61 v21.44,61 | U$1.P$22 7.5,38.12 7.5,38.75 7.88,38.75 9.12,40 9.12,45.74 7.96,46.91 6.75,46.91 5.71,47.94 5.71,49.21 v6.03,49.53
D1_HV  (via drill 0.35)
  Top 0.3: IC2.15 IC2.16 | v33.34,50.48 v33.34,48.26
  Bottom 0.3: IC2.16 28.38,55 32.88,55 33.62,54.25 33.62,50.77 v33.34,50.48 | J3.23 22,51.88 22.25,51.88 22.75,51.38 22.88,51.38 25.93,48.32 29.34,48.32 29.4,48.26 v33.34,48.26
D1_HV_SLLC
  Top 0.3: J2.23 86.75,52 89.75,55 89.75,64.62 92,66.88 B3.HV3
D1_LV
  Top 0.3: U$2.22/A8 122,51.5 123.38,52.88 123.38,56.62 122.38,57.62 114.12,57.62 105,66.75 102.25,66.75 102.25,66.88 B3.LV3
D2
  Top 0.3: U$1.P$32 7.5,50.88 9.75,50.88 11,52.12 14.62,52.12 14.75,52.25 15,52.25 17.5,54.75 17.5,55.12 19.75,57.38 23.25,57.38 25.88,60 25.88,68.12 27.12,69.38 29.88,69.38 34.12,65.12 35.88,65.12 IC2.9
  Bottom 0.3: IC2.9 IC2.8
D2_HV
  Top 0.3: IC2.11 IC2.12 28.38,65 28.38,64.62 30,63 30,54.5 29,53.5 26.62,53.5 22.62,49.5 22,49.5 J3.21
D2_HV_SLLC
  Top 0.3: J2.21 86.75,49.5 90.38,53.12 90.38,57.5 92,59.12 92,59.25 B3.HV2
D2_LV
  Top 0.3: U$2.23/A9 121.88,53.88 120.89,52.88 118.11,52.88 107.88,63.12 105.88,63.12 102.25,59.5 102.25,59.38 B3.LV2
D3  (via drill 0.35)
  Top 0.3: IC2.3 35.75,49.88 35.61,49.88 31.82,53.67 v31.82,57.32 | v19.73,62.87 19.72,62.87 17.33,65.25 6.06,65.25 3.25,62.43 v3.25,43.88
  Bottom 0.3: U$1.P$26 3.95,43.18 v3.25,43.88 | v19.73,62.87 20.68,62.87 22.18,61.37 24.26,61.37 27,58.62 29.56,58.62 30.86,57.32 v31.82,57.32 | IC2.3 IC2.2
D3_HV  (via drill 0.35)
  Top 0.3: IC2.18 27.94,49.53 26.99,49.53 26,48.54 v26,46.87
  Bottom 0.3: IC2.17 IC2.18 | v26,46.87 25.76,46.62 22.12,46.62 22,46.75 J3.19
D3_HV_SLLC
  Top 0.3: J2.19 86.75,46.88 90.38,50.5 90.38,52.06 91.88,53.56 91.88,56.62 92,56.75 B3.HV1
D3_LV
  Top 0.3: U$2.9/CS 105.25,37.62 105.25,39.92 104.62,40.55 104.62,54.12 102.25,56.5 102.25,56.75 B3.LV1
D4  (via drill 0.35)
  Top 0.3: U$1.P$18 7.38,33 7.12,33 4.88,30.75 4.88,9.02 7.67,6.22 9.56,6.22 10.64,7.3 v10.79,7.3 | v24.88,14.67 24.83,14.67 24.52,14.36 20.52,14.36 16.91,10.75 14.1,10.75 13.34,9.99 v13.34,9.84
  Bottom 0.3: IC4.2 IC4.3 36.38,17.75 34.57,15.94 29.64,15.94 28.37,14.67 v24.88,14.67 | v10.79,7.3 v13.34,9.84
D4_HV  (via drill 0.35)
  Top 0.3: IC4.18 IC4.17 | v39.5,12.62 39.5,13.88 47.25,21.62 v47.25,24.62 | v31.62,27.88 31.62,34.16 31.18,34.62 v30.22,34.62 | v26.5,36.75 23.38,39.88 23.38,42.88 22,44.25 J3.17
  Bottom 0.3: v39.5,12.62 38.62,12.62 36.25,10.25 IC4.18 | v47.25,24.62 47.25,26.21 46.84,26.62 37.62,26.62 36.38,27.88 v31.62,27.88 | v30.22,34.62 28.09,36.75 v26.5,36.75
D4_HV_SLLC
  Top 0.3: J2.17 86.75,44.38 90.38,48 90.38,49.75 92,51.38 B4.HV4
D4_LV
  Top 0.3: B4.LV4 102.25,51.38 102.25,51.25 104,49.5 104,40.42 104.75,39.68 104.75,36.59 106.68,34.65 U$2.10/CS
D5  (via drill 0.35)
  Top 0.3: IC4.8 IC4.9 20.88,17.88 19.25,19.5 v15.25,19.5 | v14.7,21.64 14.37,21.64 11.88,24.12 11,24.12 9.88,25.25 9.88,28.88 8.65,30.1 8.65,33.51 7.96,34.21 4.76,34.21 4.76,37.55 6.66,39.45 7.96,39.45 8.65,40.15 8.65,41.13 7.96,41.83 4.76,41.83 v4.76,45.72
  Bottom 0.3: v15.25,19.5 15.25,21.09 v14.7,21.64 | U$1.P$28 v4.76,45.72
D5_HV  (via drill 0.35)
  Top 0.3: v28.74,7.38 29.62,8.26 29.62,11.25 28.38,12.5 22.25,12.5 21,11.25 21,10.25 IC4.12 | v37.75,8.38 39.12,8.38 40.25,9.5 40.25,11.5 v49.87,21.11 | v54.01,24.94 54.01,26.11 v48,32.12 | v38.5,36.51 36.12,36.51 32.26,40.38 30.25,40.38 29.5,41.12 29.5,42.12 28.12,43.5 25.19,43.5 24.76,43.07 v24.76,41.48
  Bottom 0.3: IC4.12 IC4.11 | v28.74,7.38 28.74,6.88 36.25,6.88 v37.75,8.38 | v54.01,24.94 50.18,21.11 v49.87,21.11 | v48,32.12 43.62,36.5 43.38,36.5 43.25,36.38 38.63,36.38 v38.5,36.51 | v24.76,41.48 24.24,42 22.12,42 22,41.88 J3.15
D5_HV_SLLC
  Top 0.3: J2.15 86.75,41.88 90.38,45.5 90.38,47.12 92,48.75 92,48.88 B4.HV3
D5_LV  (via drill 0.35)
  Top 0.3: v116.53,32.28 114.74,34.06 114.74,34.76 110.25,39.25 107.7,39.25 107.13,39.83 106.06,39.83 105.41,40.47 105.41,40.96 105.25,41.12 105.25,47.25 v105.38,47.38
  Bottom 0.3: v116.53,32.28 120.06,28.75 121.75,28.75 121.88,28.62 U$2.13/SCK | v105.38,47.38 104,48.75 102.38,48.75 102.25,48.88 B4.LV3
D6  (via drill 0.35)
  Top 0.3: v12.05,5.05 10.78,3.79 8.64,3.79 3.12,9.3 3.12,36.62 7.12,40.62 7.38,40.62 U$1.P$24 | v14.12,16.02 14.5,16.41 14.5,19.88 14.88,20.25 23.88,20.25 26,18.12 26,17.88 IC4.7
  Bottom 0.3: IC4.7 IC4.6 | v12.05,5.05 14.43,7.44 14.43,15.7 v14.12,16.02
D6_HV  (via drill 0.35)
  Top 0.3: IC4.14 IC4.13 | v53.01,22.57 53.01,22.74 46.25,29.5 v46.25,30.5 | v38.5,33.75 35.25,33.75 31.32,37.68 27.33,37.68 v25.25,39.76 | v35.79,7.62 39.09,7.62 40.02,8.56 40.78,8.56 40.85,8.49 41.74,8.49 42.86,9.61 42.86,12.74 v49.98,19.86
  Bottom 0.3: v35.79,7.62 31.25,7.62 30.75,8.12 27.25,8.12 26.38,9 26.12,9 26.12,10.12 IC4.14 | v53.01,22.57 50.3,19.86 v49.98,19.86 | v46.25,30.5 43,33.75 v38.5,33.75 | v25.25,39.76 24.49,39 22.12,39 22,39.12 J3.13
D6_HV_SLLC
  Top 0.3: B4.HV2 91.76,40.96 90.17,40.96 88.45,39.24 J2.13
D6_LV
  Top 0.3: B4.LV2 102.25,41.25 102.25,41.12 104,39.38 104,36.41 105.25,35.16 105.25,34.77 105.41,34.61 105.41,32.7 106.68,31.43 U$2.11/MOSI
D7  (via drill 0.35)
  Top 0.3: v13.5,24 16,21.5 18,21.5 v18.12,21.62 | v25.12,20.12 28.75,20.12 31,17.88 IC4.5
  Bottom 0.3: v13.5,24 13.5,30.62 12.5,31.62 12,31.62 11.88,31.75 11,31.75 10.88,31.88 9.75,31.88 9.75,33.25 7.5,35.5 U$1.P$20 | v18.12,21.62 19.25,20.5 24.75,20.5 v25.12,20.12 | IC4.4 IC4.5
D7_HV
  Top 0.3: J3.11 22,36.58 22.57,36 32.29,36 35.04,33.25 36.29,33.25 36.83,32.7 36.83,31.94 36.77,31.88 36.77,29.72 36.83,29.66 36.83,27.37 36.39,26.94 36.39,22.14 33.7,19.45 33.23,19.45 32.13,18.35 32.13,14.22 31.12,13.22 31.12,10.25 IC4.16
  Bottom 0.3: IC4.16 IC4.15
D7_HV_SLLC
  Top 0.3: J2.11 86.75,36.75 87.38,36.75 87.38,37.12 87.8,37.55 92,37.55 92,38.62 B4.HV1
D7_LV
  Top 0.3: U$2.12/MISO 106.62,28.62 105.5,29.75 105.5,30.12 104.78,30.85 104.78,32.07 104.14,32.7 104.14,34.88 102.25,36.77 102.25,38.62 B4.LV1
FLIPFLOP_CLR  (via drill 0.35)
  Top 0.3: IC5.1 42.13,62.55 40.75,61.16 40.75,57.88 41.12,57.5 41.12,53.84 38.9,51.61 38.9,51.28 v38.73,51.12 | v36.88,39.88 38.38,39.88 38.38,41.25 36.1,43.53 34.97,43.53 34.12,44.38 34.12,45.12 34.88,45.88 36.62,45.88 38.9,48.15 38.73,48.3 v38.73,48.58 | v28.5,33.62 28.25,33.62 23.38,28.75 23.38,28 22,26.62 J3.3
  Bottom 0.3: v36.88,39.88 30.62,33.62 v28.5,33.62 | v38.73,51.12 v38.73,48.58
FLIPFLOP_CLR_HV_SLLC
  Top 0.3: J2.3 86.75,26.5 90.5,22.75 90.5,22.38 92,20.88 92,20.75 B2.HV1
FLIPFLOP_CLR_LV
  Top 0.3: U$2.25 106.62,21 106,21.62 102.88,21.62 102.25,21 102.25,20.75 B2.LV1
FLIPFLOP_PRE  (via drill 0.35)
  Top 0.3: IC5.4 49.85,63.74 49.02,64.57 43.42,64.57 43.25,64.39 43.25,61.27 42.13,60.16 v42.13,58.88 | v40.12,57 37,53.88 v32.88,53.88
  Bottom 0.3: v42.13,58.88 40.25,57 v40.12,57 | v32.88,53.88 32.62,53.62 29.38,53.62 29.25,53.5 27.12,53.5 25.75,54.88 25.75,56.5 25.25,56.5 22.75,59 21.12,59 20.62,58.5 20.62,57.75 18.83,57.75 16.69,59.88 15,58.19 15,53.75 17.12,51.62 17.12,50.5 17.46,50.16 17.46,48.9 18.36,48 18.5,48 19.38,47.12 19.38,46.88 J3.20
FLIPFLOP_PRE_HV  (via drill 0.35)
  Top 0.3: v87.47,9.53 82.25,14.75 81.25,14.75 81.25,22.25 80.5,23 80.5,45.5 v80.38,45.62
  Bottom 0.3: v87.47,9.53 90.5,6.5 90.5,4.43 B1.HV1 | v80.38,45.62 80.44,45.56 82.82,45.56 84.01,46.75 84.12,46.75 J2.20
FLIPFLOP_PRE_LV
  Top 0.3: U$2.29 106.62,10.75 105.39,9.51 105.39,7.87 104,6.48 104,4.75 102.25,3 102.25,2.88 B1.LV1
GND
  pour Top: 0,73.98 0.31,-0.32 142.24,0.56 142.24,73.1
INTERUPT_TO_TRS80_
  Top 0.3: J3.14 19.33,39.37 R7.2 14.92,38.1 U$1.P$21
INTERUPT_TO_TRS80_HV_SLLC_  (via drill 0.35)
  Top 0.3: v79.86,18.49 79,19.36 79,34.31 79.43,34.74 79.43,38.04 v79.06,38.42 | v89.25,17.75 89.25,17.72 89.72,17.25 98.48,17.25 v98.48,17.12 | v132.98,15.73 135.5,18.25 135.5,21 137.12,22.62 137.12,22.75 B5.HV2
  Bottom 0.3: v79.86,18.49 82.61,15.75 87.25,15.75 v89.25,17.75 | v98.48,17.12 98.61,17 103,17 105.5,14.5 108.12,14.5 110.5,12.12 124.62,12.12 126,10.75 127.12,10.75 127.25,10.62 127.88,10.62 v132.98,15.73 | J2.14 79.88,39.24 v79.06,38.42
INTERUPT_TO_TRS80_LV_  (via drill 0.35)
  Top 0.3: v117.11,25.23 117.11,26.5 110.94,32.66 110.94,37.81 110,38.75 106.75,38.75 U$2.8
  Bottom 0.3: v117.11,25.23 117.58,24.75 124.38,24.75 126.25,22.88 127,22.88 B5.LV2
N$1
  Bottom 0.3: U$2.AREF U$2.3V3_LO
N$2
  Bottom 0.3: RGB_LED1.2 126.36,68.9 R2.2
N$3  (via drill 0.35)
  Top 0.3: v120.3,4.5 117.38,7.42 117.38,13.25 115.75,14.88 v115.75,16.75 | v113.99,18.89 113.26,19.61 113.26,21.86 108.81,26.31 108.81,36.19 v109.12,36.51
  Bottom 0.3: v120.3,4.5 123.12,4.5 124.38,3.25 R6.1 | v115.75,16.75 115.75,17.12 v113.99,18.89 | U$2.2 106.75,53.88 107.12,53.88 109.5,51.5 110.25,51.5 110.5,51.75 115.39,51.75 115.39,39.83 112.08,36.51 v109.12,36.51
N$4  (via drill 0.35)
  Top 0.3: v120.33,44.77 121.33,44.77 121.47,44.91 122.37,44.91 122.51,44.77 125.16,44.77 125.86,44.06 127.57,44.06 128.75,42.88 128.75,33.49 v129.22,33.02 | v129.22,30.48 128.86,30.12 128.86,27.26 129.38,26.75 129.38,12.12 129.9,11.61 132.27,11.61 132.97,10.91 132.97,9.92 132.27,9.22 131.28,9.22 130.26,10.25 129.46,10.25 128.5,9.29 128.5,8.32 127.42,7.24 125.99,7.24 R5.1 | v113.38,46.75 114.09,46.04 115.89,46.04 v116.84,45.09
  Bottom 0.3: v113.38,46.75 111.12,49 109.38,49 107,51.38 106.75,51.38 U$2.3/CANTX | v116.84,45.09 120.02,45.09 v120.33,44.77 | v129.22,33.02 v129.22,30.48
N$5  (via drill 0.35)
  Top 0.3: v121.25,7 118.25,10 v118.25,17.61 | v116.17,20.33 109.88,26.62 v109.88,37.75 | v111.69,39.57 110.38,40.88 v110.38,42 | v108.18,44.83 108.25,44.9 v108.25,47
  Bottom 0.3: v121.25,7 123.12,7 124.38,8.25 R4.1 | v118.25,17.61 116.17,19.69 v116.17,20.33 | v111.69,39.57 v109.88,37.75 | v110.38,42 110.38,42.63 v108.18,44.83 | v108.25,47 106.75,48.5 106.75,48.88 U$2.4/CANRX
N$6  (via drill 0.35)
  Top 0.3: v111.12,58.75 108.25,55.88 108.25,48.12 106.75,46.62 106.75,46.38 U$2.5 | v113.26,59.93 113.35,60.02 113.35,62.55 113.98,63.18 121.03,63.18 121.07,63.14 121.68,63.14 123.51,64.97 R3.1
  Bottom 0.3: v113.26,59.93 112.08,58.75 v111.12,58.75
N$7  (via drill 0.35)
  Top 0.3: v113.61,55.31 113.41,55.31 112.71,54.61 112.71,54.09 112.25,53.62 112.25,50.62 111.38,49.75 111.38,44.38 110.38,43.38 107.12,43.38 U$2.6 | R2.1 122.24,68.58 121.38,67.72 v121.38,63.88
  Bottom 0.3: v121.38,63.88 113.61,56.12 v113.61,55.31
N$8  (via drill 0.35)
  Top 0.3: v108.25,42.38 108.88,42.38 109.25,42.75 110.5,42.75 112,44.25 112,49.62 112.88,50.5 112.88,53 113.35,53.47 v113.35,53.66 | R1.1 121.6,70.48 120.25,69.13 v120.25,64.83
  Bottom 0.3: v120.25,64.83 120.25,64.77 112.39,56.91 112.39,54.61 v113.35,53.66 | v108.25,42.38 107.5,41.62 107.38,41.62 107.12,41.38 106.75,41.38 U$2.7
N$10
  Bottom 0.3: RGB_LED1.1 130.76,70.48 R1.2
N$15
  Bottom 0.3: RGB_LED1.4 126.62,66.1 R3.2
N$19
  Top 0.3: R4.2 128,9.26 128,9.5 129.25,10.75 130.47,10.75 130.81,10.41 RGB_LED2.1
N$20
  Top 0.3: R5.2 127,5.75 129.75,8.5 129.75,8.88 RGB_LED2.2
N$21
  Top 0.3: R6.2 127,3.25 129.75,6 RGB_LED2.4
NOTHING1_HV_SLLC  (via drill 0.35)
  Top 0.3: v89.38,35.83 89.8,36.25 95.38,36.25 95.38,71.25 96.12,72 124,72 124.5,71.5 126.47,71.5 127.12,70.84 127.12,60.88 131.25,56.75 131.25,54.88 135.12,51 v135.12,45 | v135.12,42.88 135.75,42.25 135.75,41.5 137.12,40.12 B6.HV2
  Bottom 0.3: v89.38,35.83 89.38,23 89.5,22.88 89.5,22.67 89.67,22.5 89.67,20 89.22,19.55 87.14,19.55 87.11,19.59 85.61,19.59 85.58,19.55 81.95,19.55 80.75,20.75 79.75,20.75 79.75,26.27 82.11,28.62 83.75,28.62 84.12,29 J2.6 | v135.12,42.88 v135.12,45
NOTHING1_LV  (via drill 0.35)
  Top 0.3: v118.68,23.33 119.75,24.39 119.75,29.5 120.38,30.12 120.38,32.21 124.62,32.21 124.62,37.5 127,39.88 B6.LV2
  Bottom 0.3: v118.68,23.33 116.99,23.33 116.99,20.76 121.88,15.88 U$2.38/A19
NOTHING2_HV_SLLC  (via drill 0.35)
  Top 0.3: v99.75,36.15 99.75,32.12 97.47,29.84 97.47,19.19 91.18,19.19 88.47,21.91 v88.27,21.91 | v119.08,42.54 117.8,41.25 v114.01,41.25 | v131.03,44.38 131.88,44.38 132.62,43.62 136.62,43.62 136.62,43.38 137.12,42.88 137.12,42.62 B6.HV1
  Bottom 0.3: v99.75,36.15 100.23,36.62 104.5,36.62 105.38,37.5 107.23,37.5 110.98,41.25 v114.01,41.25 | v131.03,44.38 131.03,44.4 130.8,44.62 125.93,44.62 123.84,42.54 v119.08,42.54 | J2.4 82,26.54 80.28,24.82 80.28,22.91 80.71,22.48 80.8,22.48 82.65,20.64 86.6,20.64 87.64,21.69 88.04,21.69 v88.27,21.91
NOTHING2_LV  (via drill 0.35)
  Top 0.3: v118.06,21.07 117.3,21.83 117.3,23.34 119.12,25.17 119.12,29.62 119.75,30.25 119.75,35.62 121.75,37.62 123.05,37.62 123.05,38.42 127,42.38 B6.LV1
  Bottom 0.3: v118.06,21.07 120.26,18.86 121.01,18.86 121.25,18.62 121.75,18.62 121.88,18.5 U$2.39/A20
NOTHING3_HV_SLLC  (via drill 0.35)
  Top 0.3: v116.92,50.84 117.88,49.88 117.88,48.38 118.56,47.69 121.69,47.69 121.75,47.75 126.25,47.75 126.25,46.12 126.7,46.12 127.63,45.2 128.47,45.2 135.38,38.3 135.38,34.25 137.12,32.5 B6.HV3 | v91.39,35.51 92.44,35.51 93.34,34.61 95.25,34.61 98.74,38.1 98.74,50.87 v99.11,51.24
  Bottom 0.3: v91.39,35.51 90,34.12 90,22.88 90.17,22.7 90.17,19.68 89.53,19.05 86.94,19.05 86.9,19.09 85.82,19.09 85.78,19.05 81.6,19.05 81.23,19.42 81.23,19.43 80.47,20.19 79.56,20.19 78.94,20.81 78.94,27.07 83.25,31.38 84,31.38 84.12,31.5 J2.8 | v99.11,51.24 101.36,53.49 103.61,53.49 105.59,55.47 105.59,56.97 106.23,57.6 107.13,57.6 107.95,56.79 107.95,54.8 108.95,53.8 110.31,53.8 110.94,53.16 110.94,52.57 111.26,52.25 116.02,52.25 116.92,51.36 v116.92,50.84
NOTHING3_LV  (via drill 0.35)
  Top 0.3: v120.25,19.93 120.25,18.25 120.5,18 120.5,14.75 121.88,13.38 U$2.37/A18 | v119.12,22.01 120.38,23.26 120.38,28.62 121.75,30 124,30 v124.5,30.5
  Bottom 0.3: v120.25,19.93 120.25,20.89 v119.12,22.01 | v124.5,30.5 126.38,32.38 B6.LV3
RAS_
  Bottom 0.3: IC6.1 59,24.75 57.75,23.5 57.2,23.5 48.31,14.61 33.34,14.61 33.02,14.92 29.84,14.92 28.26,13.34 24.5,13.34 23.08,14.75 21.62,14.75 20.88,15.5 16.25,15.5 15.72,16.03 15.72,16.83 14.77,17.78 13.12,17.78 11.92,16.59 10.56,16.59 10.24,16.27 10.24,14.75 11.43,13.55 U$1.P$1
RD
  Top 0.3: IC1.11 49.88,42.88 52.38,42.88 60.56,51.05 60.56,61.19 61.28,61.91 IC7.1
RD_  (via drill 0.35)
  Top 0.3: IC1.13 IC1.12 | v9.12,28.12 9.12,27.88 7.88,26.62 7,26.62 6.25,25.88 6.25,24.88 7,24.12 8,24.12 9.25,22.88 9.25,15.62 9.36,15.62 10.94,14.05 15.14,14.05 v15.51,13.68 | v20.88,13.62 27.25,13.62 27.5,13.38 v29.42,13.38 | v32.5,12.62 32.75,12.62 36.13,16.01 36.66,16.01 v36.73,15.94 | 41.75,20.64 41.75,32.62 v45.17,36.05 | 41.75,20.64 41.75,20.59 | v47.62,38.5 47.62,42.12 47.38,42.38 v47.38,44 | 41.75,20.64 42.41,19.98 v42.41,19.62
  Bottom 0.3: v9.12,28.12 11.38,30.38 U$1.P$15 | v15.51,13.68 15.56,13.62 v20.88,13.62 | v32.5,12.62 32.38,12.75 30.96,12.75 30.58,13.13 29.67,13.13 v29.42,13.38 | v36.73,15.94 37.05,15.62 38.93,15.62 40.12,16.82 40.12,18.72 40.85,19.45 42.23,19.45 v42.41,19.62 | v47.62,38.5 v45.17,36.05 | v47.38,44 48.75,45.38 49.75,45.38 IC1.12
VCC
  Bottom 0.3: 105.88,42.12 106,42.29
  pour Bottom: 0,73.66 142.03,73.66 142.35,0 0,0
VCC/2  (via drill 0.35)
  Top 0.3: 111.76,16.58 111.76,17.5 116.06,17.5 120.56,22 121.42,22 121.47,22.05 122.53,22.05 124.25,20.32 B5.LV | 111.76,16.58 U$2.3V3_2 | B1.LV 102.12,8 100.5,9.62 100.5,24 102.12,25.62 B2.LV | B3.LV 102.12,61.88 100.5,60.25 100.5,45.25 102,43.75 B4.LV 102.12,43.75 100.5,42.12 100.5,27.12 101.91,25.72 B2.LV | v108.9,21.27 108.9,19.44 111.76,16.58 | v130.49,20.32 v132.72,20.32 | v107.95,22.54 107.95,22.41 105.55,22.41 B2.LV
  Bottom 0.3: v107.95,22.54 108.9,21.59 v108.9,21.27 | B6.LV 133.99,30.48 133.99,21.59 v132.72,20.32 | B5.LV v130.49,20.32
WAIT_  (via drill 0.35)
  Top 0.3: v32.83,68.5 34.83,66.5 38.21,66.5 38.26,66.45 50.67,66.45 54.5,62.62 54.88,62.62 IC5.6 | v24.88,64.62 24.56,64.62 v22.36,62.43
  Bottom 0.3: v32.83,68.5 30.7,66.38 29.38,66.38 29.25,66.5 27.12,66.5 27,66.38 26.88,66.38 25.12,64.62 v24.88,64.62 | v22.36,62.43 21.18,63.62 18.21,63.62 17.24,62.64 17.24,61.93 14.5,59.19 13.78,59.19 13.12,58.53 13.12,54.5 12.25,54.5 11.5,53.75 11.5,53.38 U$1.P$33
WR_  (via drill 0.35)
  Top 0.3: v34.96,12.12 36.38,12.12 37.25,11.25 37.25,9 36.53,8.28 36.16,8.28 36.09,8.36 35.49,8.36 35.06,7.93 35.06,7.32 35.49,6.89 39.07,6.89 40.11,7.94 v49.53,7.94 | v17.53,14.75 15.56,14.75 15.44,14.63 13.74,14.63 11.79,16.59 10.94,16.59 9.88,17.65 9.88,24.5 9.12,25.25 v9.12,26.38 | IC7.15 70.88,59.25 70.88,58.88 73.75,56 73.75,20.88 70.92,18.04 70.92,16.66 67.38,13.12 64.75,13.12 59.62,8 57.98,8 57.91,7.94 v55.88,7.94
  Bottom 0.3: v34.96,12.12 34.71,11.88 32.12,11.88 31.88,12.12 30.88,12.12 30.38,12.62 24.5,12.62 22.88,14.25 21.38,14.25 20.88,14.75 v17.53,14.75 | v9.12,26.38 10.5,27.75 10.62,27.75 10.75,27.88 11.38,27.88 U$1.P$13 | v49.53,7.94 v55.88,7.94
XX11X111111XXXX  (via drill 0.35)
  Top 0.3: v45.88,25.38 46.84,26.33 47.17,26.33 57.38,16.12 62.75,16.12 66.25,19.62 66.62,19.62 IC6.14
  Bottom 0.3: v45.88,25.38 42.62,25.38 42.5,25.25 29.62,25.25 27.62,23.25 IC3.8

## Text on the board
tNames: TRS-80 / SS Drive / V3.1